# EAGLE design preamp_module_mic_rev2 (EAGLE 9.5.1)
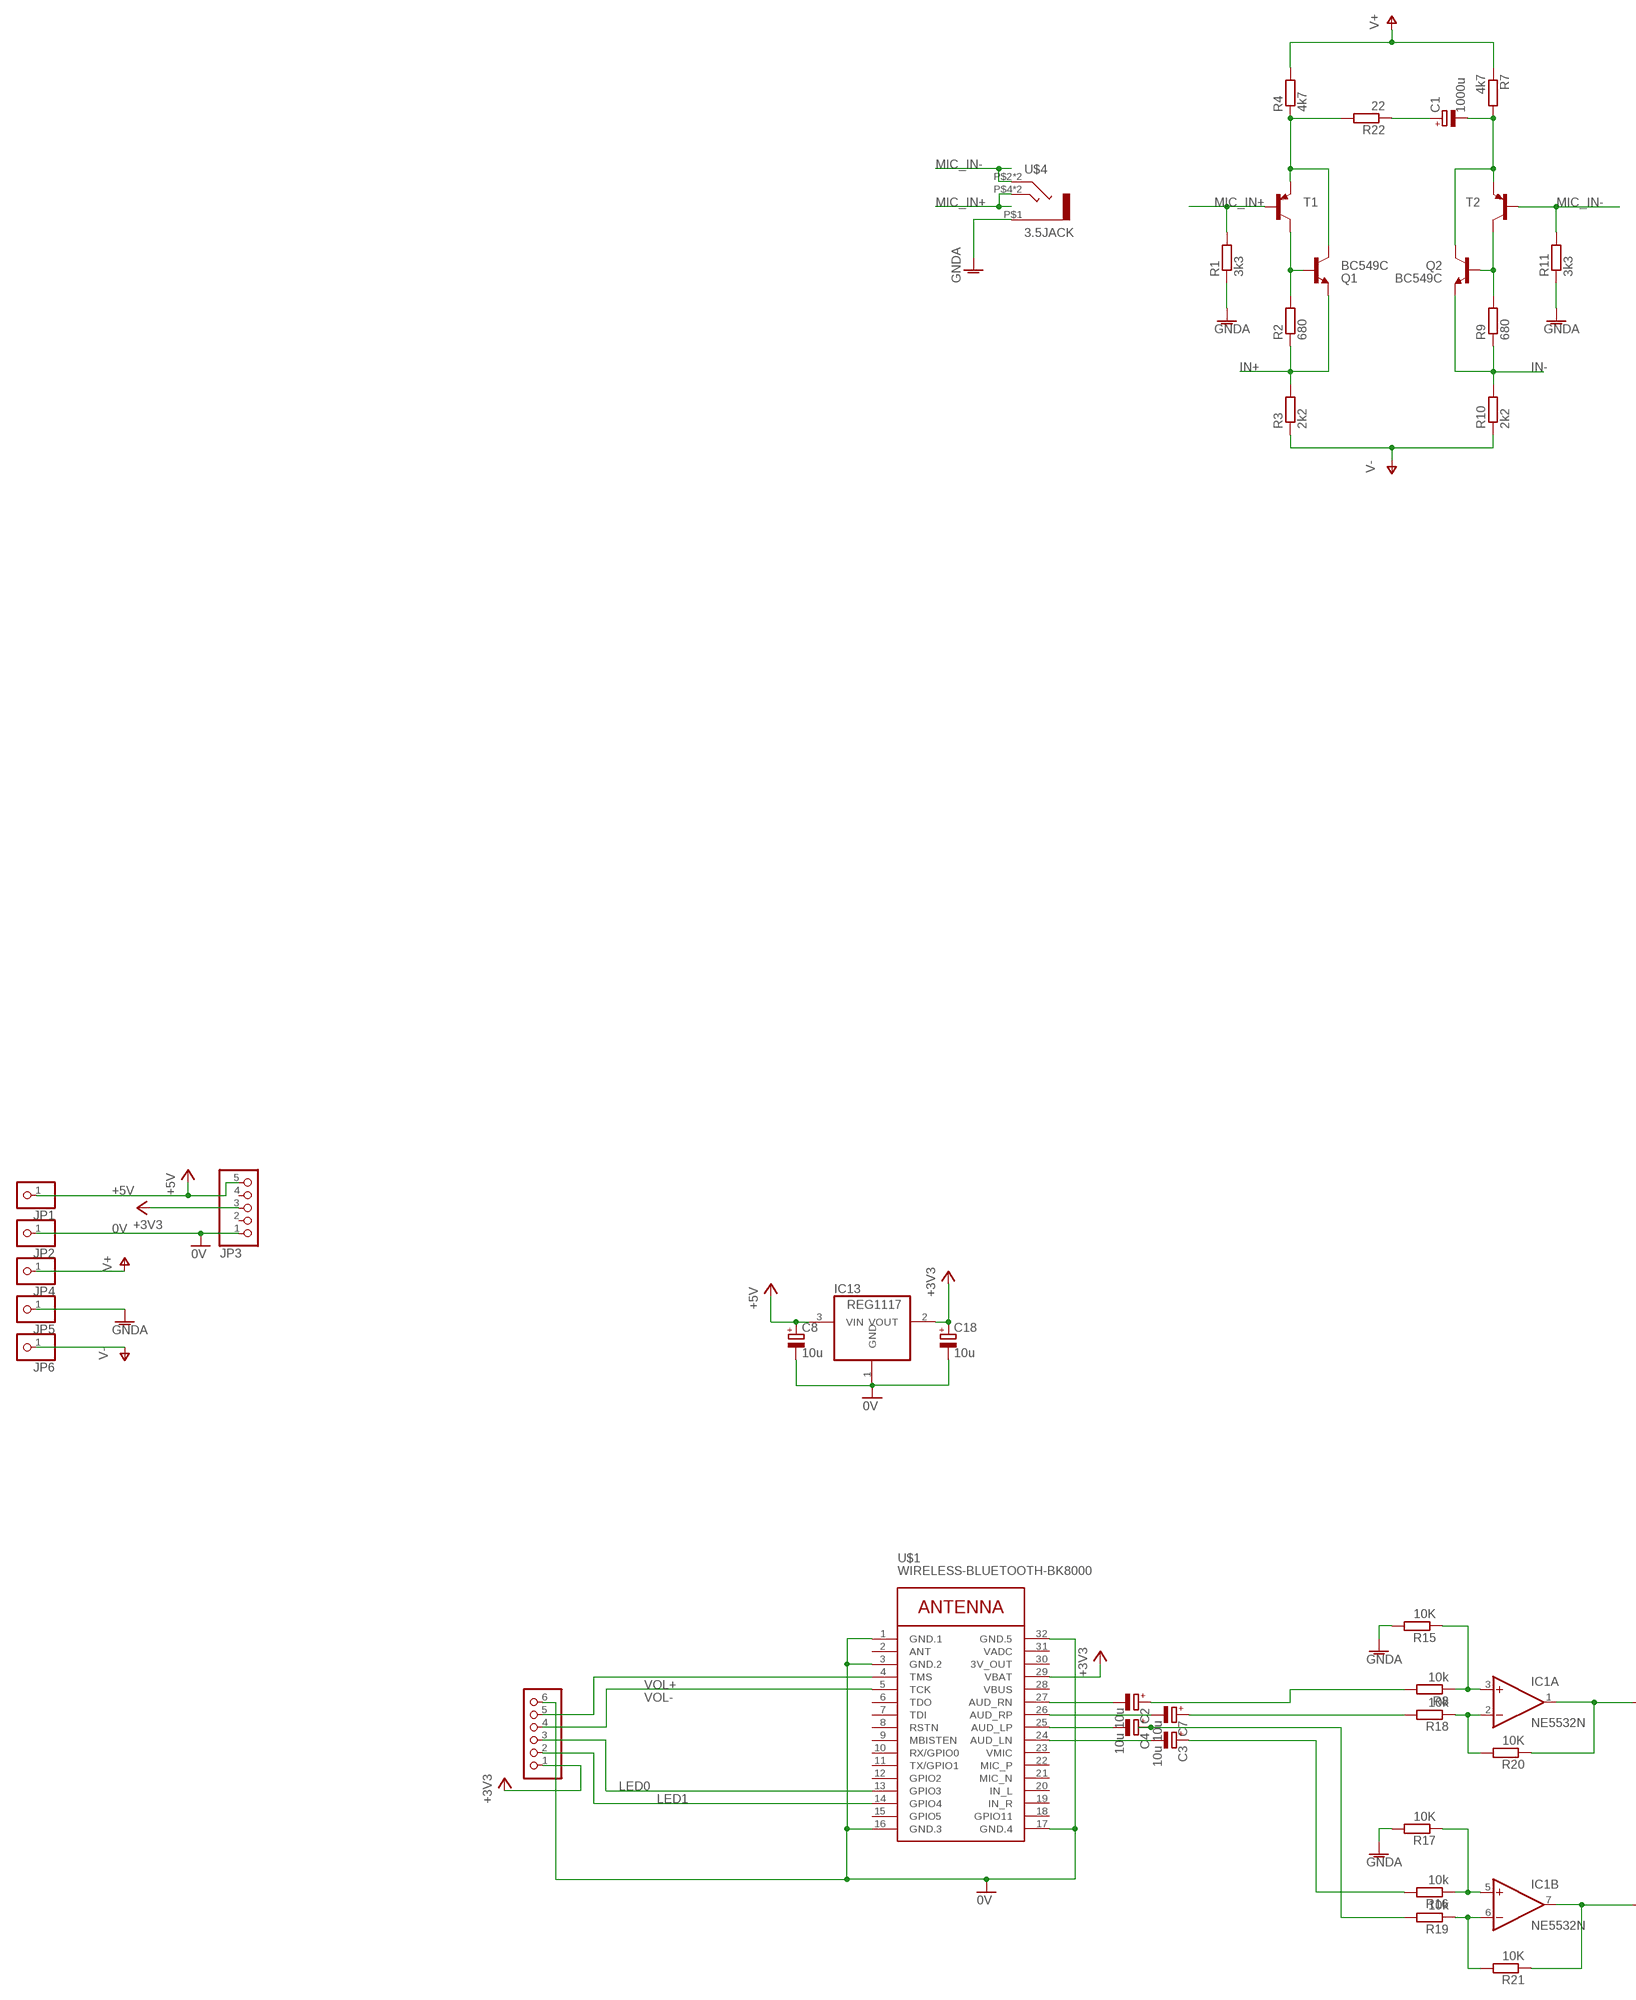
[diagram p0: schematic, sheet 1, part 1 of 2]
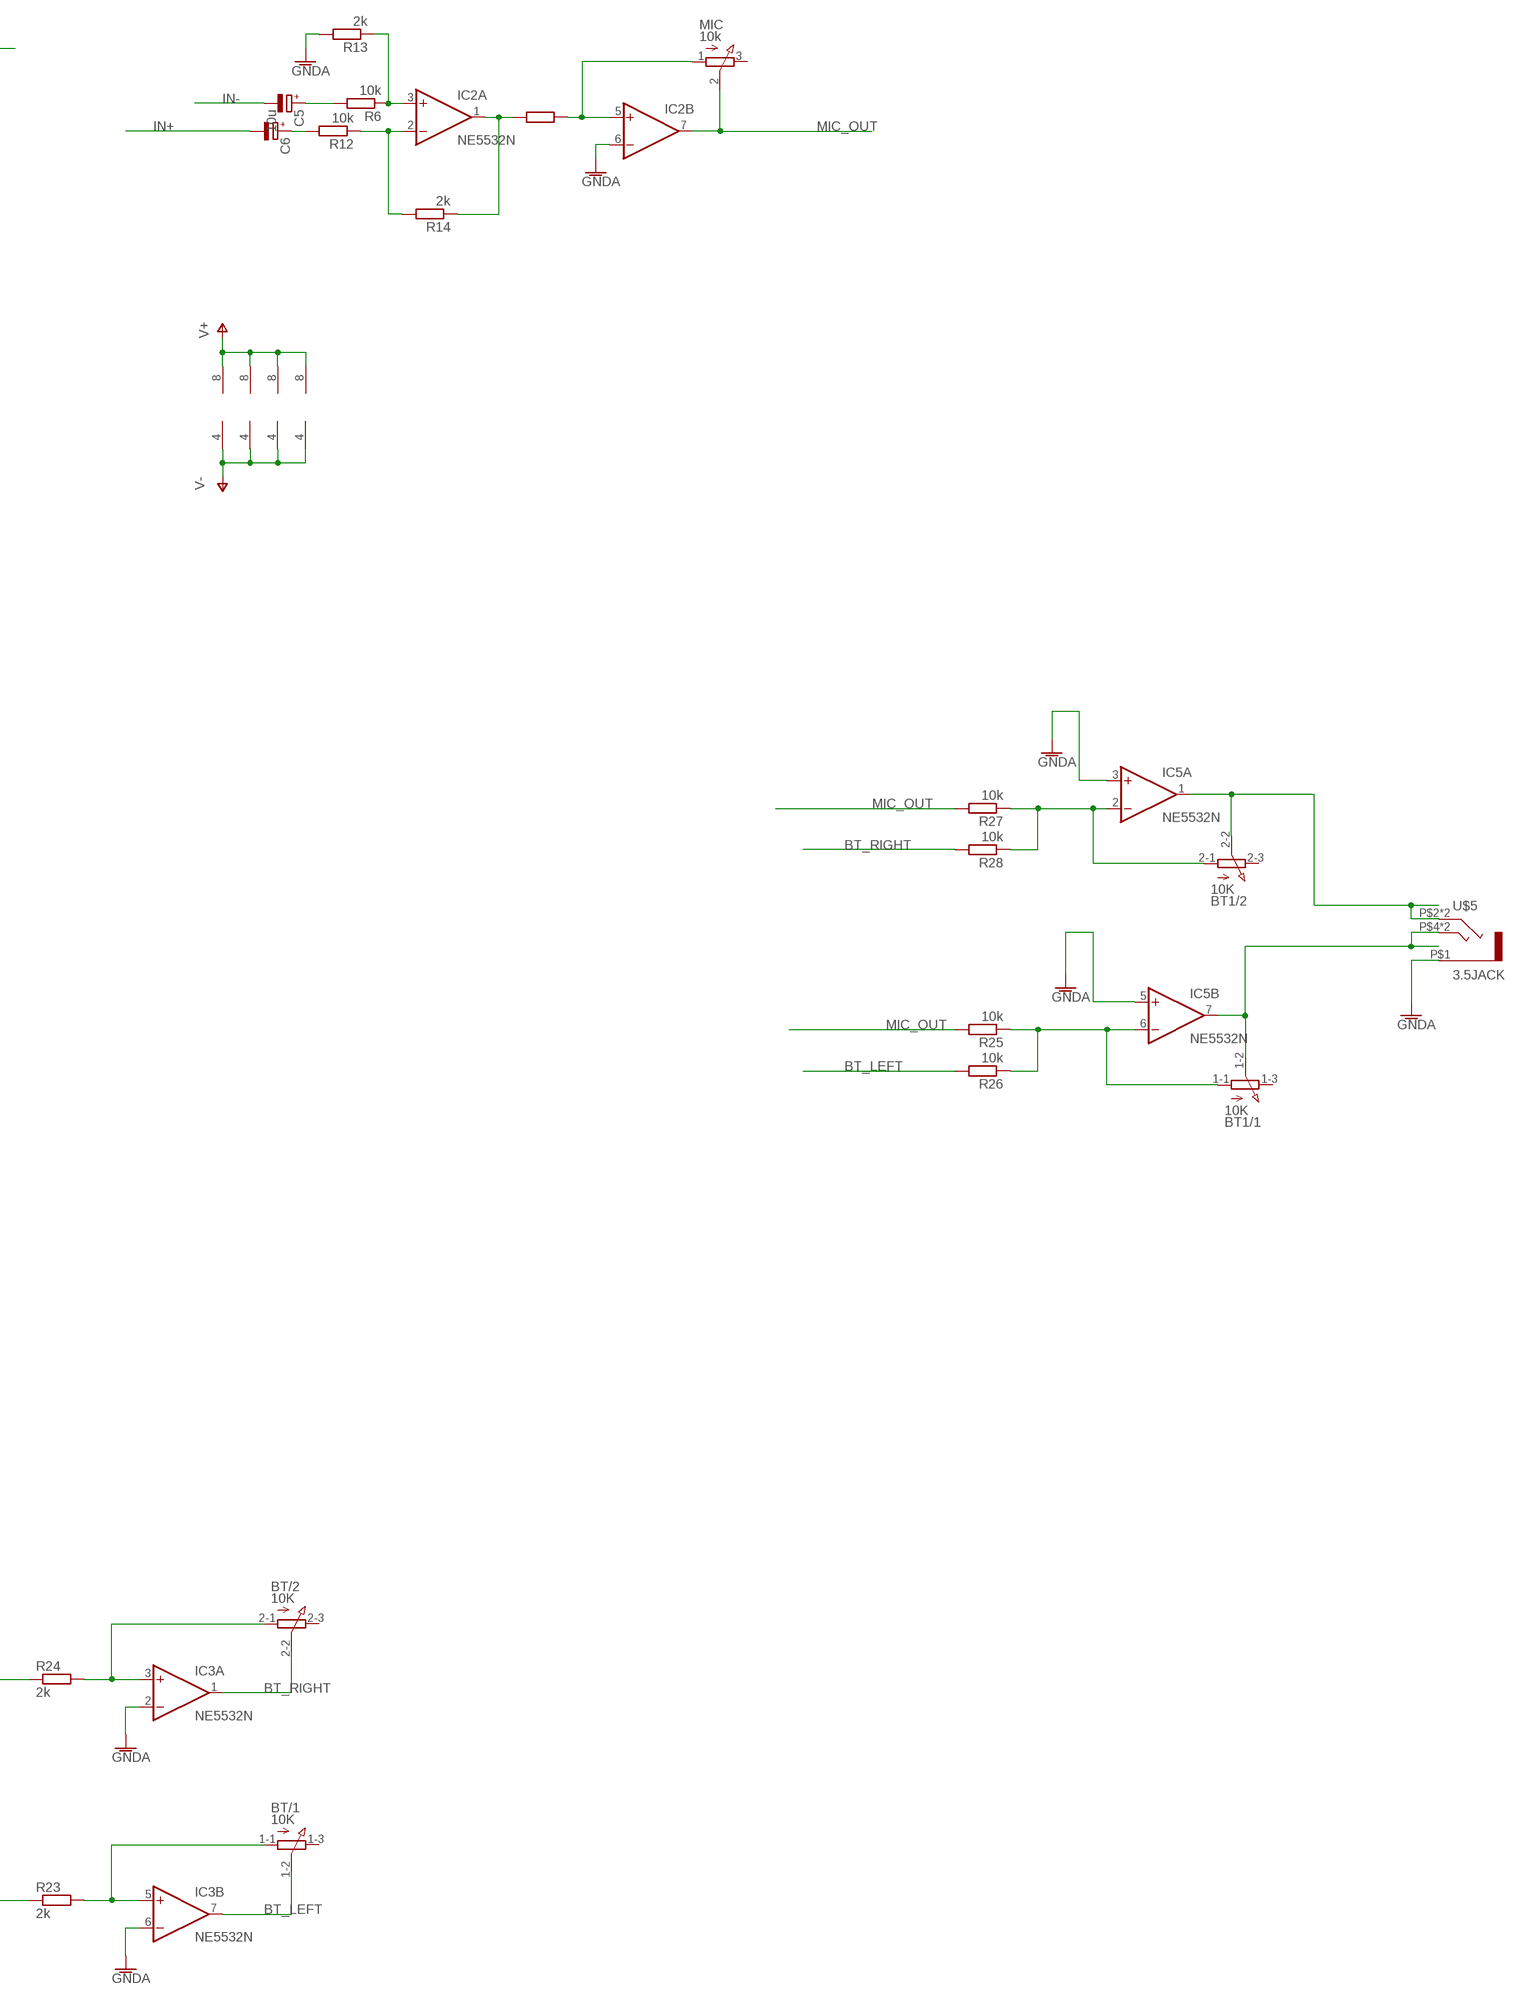
[diagram p1: schematic, sheet 1, part 2 of 2]

## Parts
BT  10K  3RP/1610G  [3RP/1610G]
BT1  10K  3RP/1610G  [3RP/1610G]
C1  1000u  CPOL-EUE5-5  [E5-5]
C2  10u  CPOL-EUE2-5  [E2-5]
C3  10u  CPOL-EUE2-5  [E2-5]
C4  10u  CPOL-EUE2-5  [E2-5]
C5  10u  CPOL-EUE2-5  [E2-5]
C6  10u  CPOL-EUE2-5  [E2-5]
C7  10u  CPOL-EUE2-5  [E2-5]
C8  10u  CPOL-EUE2-5  [E2-5]
C18  10u  CPOL-EUE2-5  [E2-5]
IC1  NE5532N  [DIL08]
IC2  NE5532N  [DIL08]
IC3  NE5532N  [DIL08]
IC5  NE5532N  [DIL08]
IC13  REG1117  [SOT223]
JP1  PINHD-1X1  [1X01]
JP2  PINHD-1X1  [1X01]
JP3  PINHD-1X5  [1X05]
JP4  PINHD-1X1  [1X01]
JP5  PINHD-1X1  [1X01]
JP6  PINHD-1X1  [1X01]
JP7  PINHD-1X6  [1X06]
MIC  10k  3RP/1610N  [3RP/1610N]
Q1  BC549C  [TO92-EBC]
Q2  BC549C  [TO92-EBC]
R1  3k3  R-EU_0207/10  [0207/10]
R2  680  R-EU_0207/10  [0207/10]
R3  2k2  R-EU_0207/10  [0207/10]
R4  4k7  R-EU_0207/10  [0207/10]
R5  2k  R-EU_0207/10  [0207/10]
R6  10k  R-EU_0207/10  [0207/10]
R7  4k7  R-EU_0207/10  [0207/10]
R8  10k  R-EU_0207/10  [0207/10]
R9  680  R-EU_0207/10  [0207/10]
R10  2k2  R-EU_0207/10  [0207/10]
R11  3k3  R-EU_0207/10  [0207/10]
R12  10k  R-EU_0207/10  [0207/10]
R13  2k  R-EU_0207/10  [0207/10]
R14  2k  R-EU_0207/10  [0207/10]
R15  10K  R-EU_0207/10  [0207/10]
R16  10k  R-EU_0207/10  [0207/10]
R17  10K  R-EU_0207/10  [0207/10]
R18  10k  R-EU_0207/10  [0207/10]
R19  10k  R-EU_0207/10  [0207/10]
R20  10K  R-EU_0207/10  [0207/10]
R21  10K  R-EU_0207/10  [0207/10]
R22  22  R-EU_0207/10  [0207/10]
R23  2k  R-EU_0207/10  [0207/10]
R24  2k  R-EU_0207/10  [0207/10]
R25  10k  R-EU_0207/10  [0207/10]
R26  10k  R-EU_0207/10  [0207/10]
R27  10k  R-EU_0207/10  [0207/10]
R28  10k  R-EU_0207/10  [0207/10]
T1  2N4403-PNP-TO92-EBC  [TO92-EBC]
T2  2N4403-PNP-TO92-EBC  [TO92-EBC]
U$1  WIRELESS-BLUETOOTH-BK8000  [WIRELESS-BLUETOOTH-BK8000]
U$4  3.5JACK  [3.5JACK]
U$5  3.5JACK  [3.5JACK]

## Nets
0V: C8.- C18.- IC13.1(GND) JP2.1 JP3.1 JP7.6 U$1.1(GND.1) U$1.3(GND.2) U$1.16(GND.3) U$1.17(GND.4) U$1.32(GND.5)
+3V3: C18.+ IC13.2(VOUT) JP3.3 JP7.1 U$1.29(VBAT)
+5V: C8.+ IC13.3(VIN) JP1.1 JP3.5
BT_LEFT: BT.1-2(/1:S) IC3.7(B:OUT) R26.2
BT_RIGHT: BT.2-2(/2:S) IC3.1(A:OUT) R28.2
GNDA: IC2.6(B:-IN) IC3.2(A:-IN) IC3.6(B:-IN) IC5.3(A:+IN) IC5.5(B:+IN) JP5.1 R1.1 R11.1 R13.2 R15.2 R17.2 U$4.P$1 U$5.P$1
IN+: C6.- Q1.E R2.1 R3.2
IN-: C5.- Q2.E R9.1 R10.2
LED0: JP7.3 U$1.13(GPIO3)
LED1: JP7.2 U$1.14(GPIO4)
MIC_IN+: R1.2 T1.B U$4.P$4 U$4.P$5
MIC_IN-: R11.2 T2.B U$4.P$2 U$4.P$3
MIC_OUT: IC2.7(B:OUT) MIC.2(S) R25.2 R27.2
N$1: Q1.B R2.2 T1.C
N$2: Q2.B R9.2 T2.C
N$3: IC2.5(B:+IN) MIC.1(A) R5.2
N$4: C1.- Q2.C R7.2 T2.E
N$5: C2.- U$1.27(AUD_RN)
N$6: Q1.C R4.1 R22.2 T1.E
N$7: IC1.3(A:+IN) R8.1 R15.1
N$8: IC1.5(B:+IN) R16.1 R17.1
N$9: C2.+ R8.2
N$10: C1.+ R22.1
N$11: C6.+ R12.2
N$12: IC2.2(A:-IN) R12.1 R14.2
N$13: C5.+ R6.2
N$14: IC2.3(A:+IN) R6.1 R13.1
N$15: IC2.1(A:OUT) R5.1 R14.1
N$16: C3.- U$1.24(AUD_LN)
N$17: C3.+ R16.2
N$18: IC1.2(A:-IN) R18.1 R20.2
N$19: IC1.6(B:-IN) R19.1 R21.2
N$20: C7.+ R18.2
N$21: IC1.1(A:OUT) R20.1 R24.1
N$22: IC1.7(B:OUT) R21.1 R23.1
N$23: BT.1-1(/1:A) IC3.5(B:+IN) R23.2
N$24: BT.2-1(/2:A) IC3.3(A:+IN) R24.2
N$25: BT1.2-1(/2:A) IC5.2(A:-IN) R27.1 R28.1
N$26: BT1.1-1(/1:A) IC5.6(B:-IN) R25.1 R26.1
N$27: BT1.2-2(/2:S) IC5.1(A:OUT) U$5.P$2 U$5.P$3
N$28: BT1.1-2(/1:S) IC5.7(B:OUT) U$5.P$4 U$5.P$5
N$73: C4.- U$1.25(AUD_LP)
N$74: C7.- U$1.26(AUD_RP)
N$85: C4.+ R19.2
V+: IC1.8(P:V+) IC2.8(P:V+) IC3.8(P:V+) IC5.8(P:V+) JP4.1 R4.2 R7.1
V-: IC1.4(P:V-) IC2.4(P:V-) IC3.4(P:V-) IC5.4(P:V-) JP6.1 R3.1 R10.1
VOL+: JP7.5 U$1.4(TMS)
VOL-: JP7.4 U$1.5(TCK)
Unconnected: BT1.1-3(/1:E) BT1.2-3(/2:E) BT.1-3(/1:E) BT.2-3(/2:E) JP3.2 JP3.4 MIC.3(E) U$1.2(ANT) U$1.6(TDO) U$1.7(TDI) U$1.8(RSTN) U$1.9(MBISTEN) U$1.10(RX/GPIO0) U$1.11(TX/GPIO1) U$1.12(GPIO2) U$1.15(GPIO5) U$1.18(GPIO11) U$1.19(IN_R) U$1.20(IN_L) U$1.21(MIC_N) U$1.22(MIC_P) U$1.23(VMIC) U$1.28(VBUS)

## Power pins joined to a net without a drawn wire
3V_OUT: U$1.30(3V_OUT)
VADC: U$1.31(VADC)

## Library data of the parts
BT BT1 = pot:3RP/1610G: 16mm Potentiometer two level Source: http://www.alphapotentiometers.net/html/16mm_pot_2.html
C1-C8 C18 = rcl:CPOL-EU: POLARIZED CAPACITOR, European symbol; SPICEPREFIX: C
IC1-IC3 IC5 = linear:NE5532: AUDIO AMPLIFIER
IC13 = burr-brown:REG1117: 800mA and 1A Low Dropout (LDO) Positive Regulator 1.8V, 2.5V, 2.85V, 3.3V, 5V, and Adj; MPN: REG1117; OC_FARNELL: 1097566; OC_NEWARK: 14P6981
JP1 JP2 JP4-JP6 = pinhead:PINHD-1X1: PIN HEADER
JP3 = pinhead:PINHD-1X5: PIN HEADER
JP7 = pinhead:PINHD-1X6: PIN HEADER
MIC = pot:3RP/1610N: 16mm Potentiometer one level Source: http://www.alphapotentiometers.net/html/16mm_pot_2.html
Q1 Q2 = transistor-npn:BC549*: NPN Transistor
R1-R28 = rcl:R-EU_: RESISTOR, European symbol; SPICEPREFIX: R
T1 T2 = transistor-neu-to92:*-PNP-: PNP Transistror
U$1 = diy-modules:WIRELESS-BLUETOOTH-BK8000: Bluetooth Audio Module based on BK8000L chip More details available here: http://www.electrodragon.com/w/BK8000L Click here to find device on ebay.com <http://www.ebay.com/sch/bk8000l+module>
U$4 U$5 = personal:3.5JACK

## Net classes
0 default: width 0.2 mm, drill 0.7 mm, clearance 0.1 mm

## Board
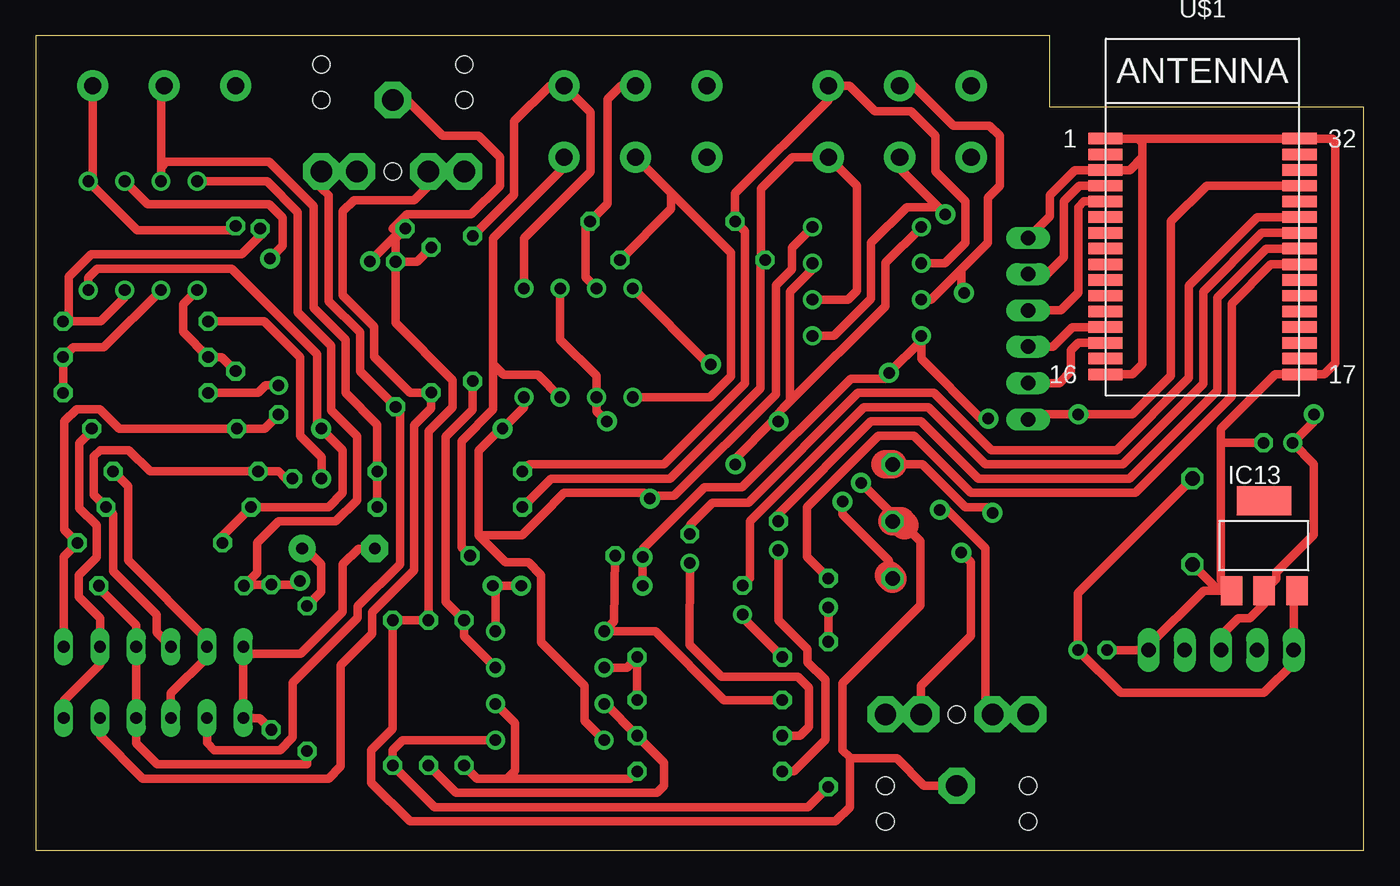
[diagram p2: board, top side]
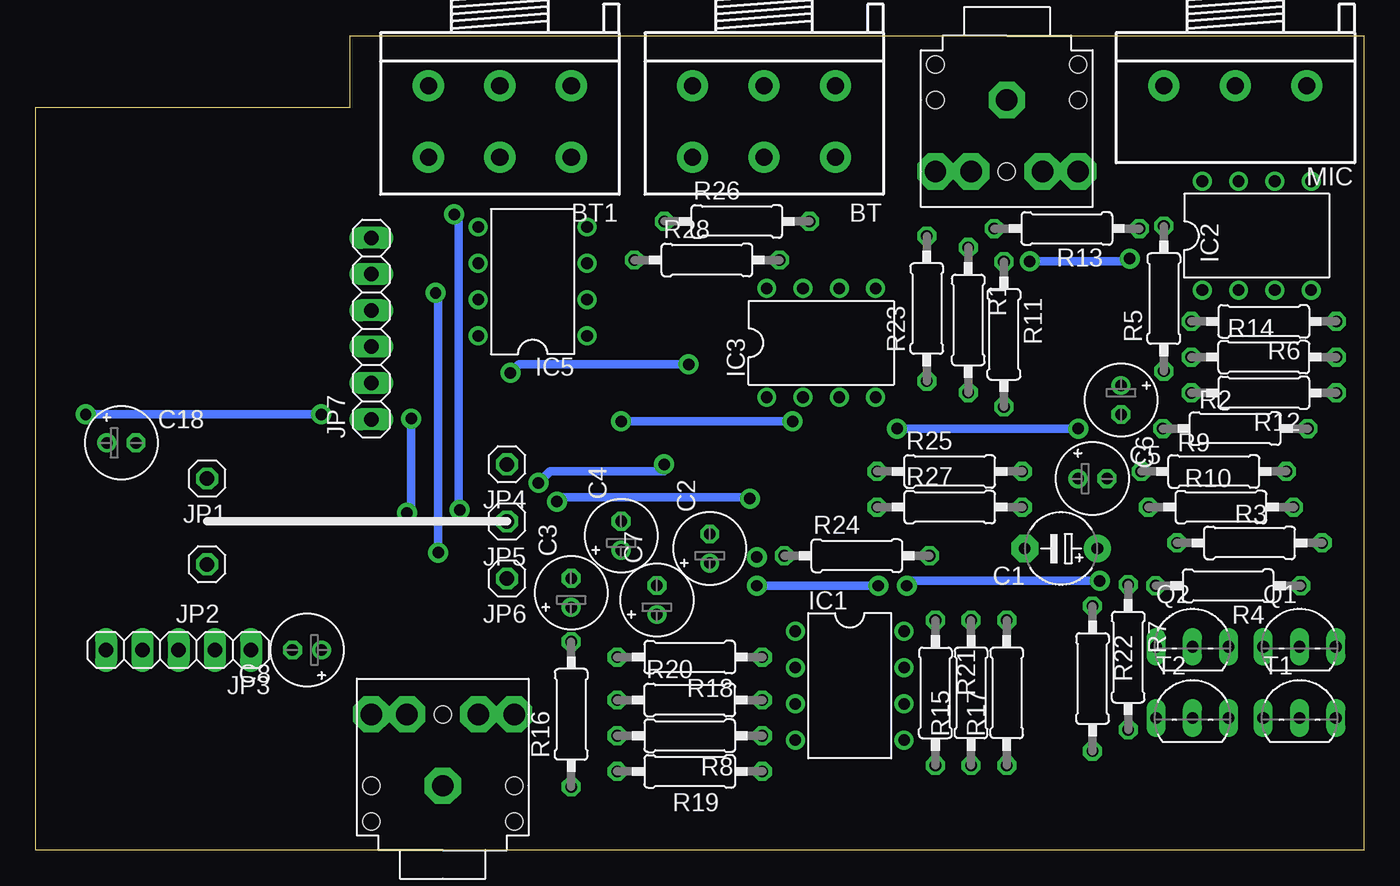
[diagram p3: board, bottom side, seen from below]

Size 93 x 57 mm. Coordinates in mm from the lower left corner, seen from the top.
Outline: 93,0 93,52 71,52 71,57 0,57 0,0 93,0
Copper layers (1*16): Top 0.035mm / dielectric 1.5mm / Bottom 0.035mm
Design rules "default *": minimum track width 0.6mm, minimum drill 0.8mm, track to track 0.4mm, track to pad 0.4mm, pad to pad 0.4mm, via to via 0.4mm, smd to smd 0.4mm, copper to edge 40mil, drill to drill 6mil, minimum pad ring 10mil, minimum via ring 8mil, stop-mask expansion 4mil, vias tented up to drill 0mil, thermal gap 10mil

### Footprints (pad centres in the part's own frame; a part is rotated, then mirrored left to right if it is on the bottom)
3RP/1610G = drill 1.2 pad 2.184: 1-1 -5,0; 1-2 0,0; 1-3 5,0; 2-1 -5,5; 2-2 0,5; 2-3 5,5
E5-5 = drill 0.813 pad 1.905: + -2.54,0 | drill 0.813 pad 1.905 octagon: - 2.54,0
E2-5 = drill 0.813 pad 1.27: + -1.016,0 | drill 0.813 pad 1.27 octagon: - 1.016,0
DIL08 = drill 0.813 pad 1.27: 1 -3.81,-3.81; 2 -1.27,-3.81; 3 1.27,-3.81; 4 3.81,-3.81; 5 3.81,3.81; 6 1.27,3.81; 7 -1.27,3.81; 8 -3.81,3.81
SOT223 = smd 1.499 x 2.007: 1 -2.261,-3.15; 2 0.025,-3.15; 3 2.311,-3.15 | smd 3.81 x 2.007: 4 0,3.15
1X01 = drill 1.016 octagon: 1 0,0
1X05 = drill 1.016 long: 1 -5.08,0; 2 -2.54,0; 3 0,0; 4 2.54,0; 5 5.08,0
1X06 = drill 1.016 long: 1 -6.35,0; 2 -3.81,0; 3 -1.27,0; 4 1.27,0; 5 3.81,0; 6 6.35,0
3RP/1610N = drill 1.2 pad 2.184: 1 -5,0; 2 0,0; 3 5,0
TO92-EBC = drill 0.813 long: B 0,-1.27; C -2.54,-1.27; E 2.54,-1.27
0207/10 = drill 0.813 octagon: 1 -5.08,0; 2 5.08,0
TO92-EBC' = drill 0.813 long: B 0,-1.27; C 2.54,-1.27; E -2.54,-1.27
WIRELESS-BLUETOOTH-BK8000 = smd 2.4 x 0.8: 1 -6.8,5.5; 2 -6.8,4.4; 3 -6.8,3.3; 4 -6.8,2.2; 5 -6.8,1.1; 6 -6.8,0; 7 -6.8,-1.1; 8 -6.8,-2.2; 9 -6.8,-3.3; 10 -6.8,-4.4; 11 -6.8,-5.5; 12 -6.8,-6.6; 13 -6.8,-7.7; 14 -6.8,-8.8; 15 -6.8,-9.9; 16 -6.8,-11; 17 6.8,-11; 18 6.8,-9.9; 19 6.8,-8.8; 20 6.8,-7.7; 21 6.8,-6.6; 22 6.8,-5.5; 23 6.8,-4.4; 24 6.8,-3.3; 25 6.8,-2.2; 26 6.8,-1.1; 27 6.8,0; 28 6.8,1.1; 29 6.8,2.2; 30 6.8,3.3; 31 6.8,4.4; 32 6.8,5.5
3.5JACK = drill 1.5 pad 2.54 octagon: P$1 0,0; P$2 5,5; P$3 5,2.5; P$4 5,-2.5; P$5 5,-5 | hole 1.2: 5,0; 0,-5; -2.5,-5; 0,5; -2.5,5

### Placement (x,y rotation side)
BT  42,53.5 180 bottom
BT1  60.5,53.5 180 bottom
C1  21.2,21.1 180 bottom
C2  45.8,21.1 90 bottom
C3  55.5,18 90 bottom
C4  52,22 90 bottom
C5  19,26 0 bottom
C6  17,31.5 270 bottom
C7  49.5,17.5 90 bottom
C8  74,14 180 bottom
C18  87,28.5 0 bottom
IC1  36,11.5 270 bottom
IC2  7.5,43 0 bottom
IC3  38,35.5 0 bottom
IC5  58.2,39.8 90 bottom
IC13  86,21.3 0 top
JP1  81,26 180 bottom
JP2  81,20 180 bottom
JP3  83,14 180 bottom
JP4  60,27 180 bottom
JP5  60,23 180 bottom
JP6  60,19 180 bottom
JP7  69.5,36.5 90 bottom
MIC  9,53.5 180 bottom
Q1  4.5,15.5 0 bottom
Q2  12,15.5 0 bottom
R1  27.7,37.1 270 bottom
R2  9,29.5 0 bottom
R3  8,21.5 0 bottom
R4  9.5,18.5 180 bottom
R5  14,38.6 90 bottom
R6  7,37 180 bottom
R7  16.5,13.5 270 bottom
R8  47.2,8 180 bottom
R9  10.5,26.5 0 bottom
R10  10,24 0 bottom
R11  25.2,36.1 270 bottom
R12  7,32 180 bottom
R13  20.8,43.5 180 bottom
R14  7,34.5 0 bottom
R15  27.5,11 90 bottom
R16  55.5,9.5 90 bottom
R17  25,11 90 bottom
R18  47.2,13.5 180 bottom
R19  47.2,5.5 180 bottom
R20  47.2,10.5 0 bottom
R21  30,11 270 bottom
R22  19,12 270 bottom
R23  30.6,37.9 90 bottom
R24  35.5,20.6 0 bottom
R25  29,26.5 0 bottom
R26  43.9,44 0 bottom
R27  29,24 0 bottom
R28  46,41.3 0 bottom
T1  [TO92-EBC']  4.5,10.5 0 bottom
T2  [TO92-EBC']  12,10.5 0 bottom
U$1  81.7,44.3 0 top
U$4  25,52.5 270 bottom
U$5  64.5,4.5 90 bottom

### Tracks (layer width: path | path; a pad name or v marks a point on that pad's centre or on a via)
0V
  Top 0.6: IC13.1 82.85,18.15 JP2.1 | IC13.1 81.78,18.15 77.92,14.29 JP3.1 C8.- | IC13.1 83,18.89 83,28.5 | 83,28.5 83,29.5 86.8,33.3 U$1.17 90.24,33.3 91,34.06 91,49.64 90.84,49.8 U$1.32 77.2,49.8 | C18.- 83,28.5 | U$1.1 77.2,49.8 | 77.2,49.8 77.5,49.5 77.5,48.5 | 77.5,48.5 76.6,47.6 U$1.3 72.77,47.6 71,45.83 71,44.35 JP7.6 | 77.5,48.5 77.5,34 76.8,33.3 U$1.16
+3V3  (via drill 0.8 pad 1.4)
  Top 0.6: v89.5,30.5 89.5,29.98 C18.+ 89.5,27.02 89.5,22.08 86.86,19.44 86.86,18.99 IC13.2 86.03,17.25 85,16.22 84.22,16.22 83,15 JP3.3 | U$1.29 82,46.5 79.5,44 79.5,33.21 76.79,30.5 v73,30.5 69.85,30.5 JP7.1
  Bottom 0.6: v89.5,30.5 v73,30.5
+5V
  Top 0.6: JP1.1 72.98,17.98 C8.+ 75.98,11 86,11 88.08,13.08 JP3.5 88.08,17.92 IC13.3
BT_LEFT
  Top 0.6: IC3.7 38.5,40.08 38.5,43.68 R26.2 40.05,45.23 40.05,52.55 41,53.5 BT.1-2
BT_RIGHT
  Top 0.6: IC3.1 47.2,31.69 48.68,33.17 48.68,41.82 44.5,46 | 44.5,46 BT.2-2 | R28.2 44.5,44.88 44.5,46
GNDA  (via drill 0.8 pad 1.4)
  Top 0.6: IC2.6 7.84,45.2 16.34,45.2 17.3,44.24 17.3,42.3 v16.4,41.4 | U$4.P$1 26,52.5 28.5,50 31,50 32.5,48.5 32.5,46.5 30.5,44.5 26,44.5 25,43.5 R13.2 | R13.2 25.2,42.82 R11.1 | R1.1 26.7,41.18 R11.1 | R11.1 25.2,36.9 29.2,32.9 29.2,31 27.5,29.3 R15.2 R17.2 25,8.5 23.5,7 23.5,4.7 26.2,2 56,2 57,3 57,6.5 | v40,30 39.27,30.73 IC3.2 39.27,33.19 36.73,35.73 IC3.6 | IC5.5 59.5,41.1 59.5,38.08 52.83,31.41 | 57,6.5 56.5,7 56.5,11.67 61.96,17.13 61.96,21.61 60.85,22.73 | 57,6.5 57.08,6.42 60.29,6.42 62.21,4.5 U$5.P$1 | IC5.3 54.39,40.65 52.83,39.09 52.83,31.41 | 52.83,31.41 52.33,30.91 51.9,30.48 51.9,30.1 v52,30 51.59,30 48.98,27.39 v48.98,26.99 | JP5.1 60,23.5 v57.8,25.7 | R13.2 25.7,43.5 v23.4,41.2
  Top 2: 60.85,22.73 60.58,23 JP5.1
  Bottom 0.6: v52,30 v40,30 | v57.8,25.7 57,26.5 48.98,26.5 v48.98,26.99 | v23.4,41.2 16.6,41.2 v16.4,41.4
IN+
  Top 0.6: Q1.E 1.96,20.54 R3.2 2,22.42 2,30 2.86,30.86 4.48,30.86 5.84,29.5 R2.1 16.02,29.5 C6.-
IN-
  Top 0.6: Q2.E 8.46,15.23 8.46,16.46 5.42,19.5 5.42,23.5 R10.2 4.06,24.86 4.06,27.56 4.5,28 6.5,28 8,26.5 R9.1 17,26.5 17.5,26 C5.-
LED0
  Top 0.6: U$1.13 72.6,36.6 71.23,35.23 JP7.3
LED1
  Top 0.6: JP7.2 71.69,32.69 72.5,33.5 72.5,35 73,35.5 U$1.14
MIC_IN+
  Top 0.6: T1.B 4.5,8 7.5,5 20.5,5 21.36,5.86 21.36,12.95 23.55,15.14 23.55,16.64 26.5,19.59 26.5,29.72 27.7,30.92 R1.2 26.2,32.02 23.7,34.52 23.7,36.64 21.51,38.84 21.51,44.71 22.3,45.5 26.5,45.5 27.5,46.5 U$4.P$4 U$4.P$5
MIC_IN-
  Top 0.6: T2.B 12,7.5 12.5,7 17.1,7 18,7.9 18,11.7 22.55,16.25 22.55,17.05 25.5,20 25.5,30.72 R11.2 22.7,33.52 22.7,36.23 20.51,38.42 20.51,45.82 20,46.33 U$4.P$2 U$4.P$3
MIC_OUT
  Top 0.6: R27.2 R25.2 23.92,29.78 21.7,32 21.7,35.71 19.45,37.96 19.45,45.06 16.34,48.17 9.17,48.17 8.77,47.77 IC2.7 8.77,53.27 MIC.2
N$1
  Top 0.6: T1.C 1.96,10.46 4.5,13 Q1.B 4.5,16.23 3,17.73 3,19.22 4.28,20.5 4.28,22.72 3.06,23.94 3.06,28.47 3.92,29.33 R2.2
N$2
  Top 0.6: T2.C 9.46,10.96 12,13.5 Q2.B 12,14.73 6.46,20.27 6.46,25.46 R9.2
N$3
  Top 0.6: R5.2 13.7,43.38 7.12,43.38 IC2.5 4,47.12 MIC.1
N$4
  Top 0.6: R7.2 15.69,9.23 T2.E Q2.C 15.04,13.73 18.54,13.73 21.5,16.69 21.5,20 22.6,21.1 C1.-
N$5
  Top 0.6: U$1.27 85.56,44.3 80.75,39.49 80.75,33.04 75.71,28 66.91,28 62.91,32 57.59,32 49.9,24.32 47.4,24.32 45.8,22.72 C2.-
N$6
  Top 0.6: R4.1 4.42,18.35 7.04,15.73 Q1.C T1.E 7.04,7.46 8.5,6 19,6 R22.2
N$7
  Top 0.6: R15.1 29.42,4 43.5,4 44,4.5 44,6.12 R8.1 39.89,10.23 IC1.3
N$8
  Top 0.6: R16.1 54.08,3 27.92,3 R17.1 25,7 25.69,7.69 IC1.5
N$9
  Top 0.6: R8.2 53.5,8 54.14,8.64 54.14,11.36 53.36,12.14 48.02,12.14 45.8,14.36 C2.+
N$10
  Top 0.6: C1.+ 18.9,21.1 20,20 20,18.08 R22.1
N$11
  Top 0.6: R12.2 15.58,32 16.1,32.52 C6.+
N$12
  Top 0.6: IC2.2 4.77,35.19 2.61,35.19 R14.2 R12.1
N$13
  Top 0.6: C5.+ 20.02,27.5 18.52,29 18.52,34.48 16,37 R6.2
N$14
  Top 0.6: IC2.3 6.23,38.69 4.54,37 R6.1 2.33,37.41 2.33,40.13 3.89,41.69 14.41,41.69 15.72,43 R13.1
N$15
  Top 0.6: IC2.1 10.31,38.19 10.31,36.27 R14.1 13.02,34.5 R5.1
N$16
  Top 0.6: C3.- 54,20.52 54,24 59,29 61.5,29 65.5,25 77,25 83.75,31.75 83.75,38.25 86.5,41 U$1.24
N$17
  Top 0.6: R16.2 C3.+
N$18
  Top 0.6: R20.2 R18.1 41.39,12.77 IC1.2
N$19
  Top 0.6: R19.1 41.62,5 33,5 | 33,5 30.92,5 R21.2 | 33,5 33.55,5.55 33.55,8.87 IC1.6
N$20
  Top 0.6: R18.2 49.5,16.28 C7.+
N$21
  Top 0.6: R20.1 48.2,10.5 43.39,15.31 IC1.1 40.51,16.01 R24.1
N$22
  Top 0.6: R23.1 30.6,30.82 28.7,28.92 28.7,17.38 R21.1 30,14.96 IC1.7
N$23
  Top 0.6: R23.2 33.5,45.88 33.5,51 36,53.5 BT.1-1 38.86,51.64 38.86,47.48 34.19,42.81 IC3.5
N$24
  Top 0.6: IC3.3 35.16,33.26 32.77,33.26 32.03,34 | BT.2-1 37,47.8 32.03,42.83 32.03,34 | R24.2 29.82,21.2 29.82,28.63 32.03,30.84 32.03,34
N$25
  Top 0.6: R27.1 36.08,26 44.41,26 50.75,32.34 50.75,40.97 R28.1 50.78,41.6 50.78,46.28 53,48.5 BT1.2-1 57.5,46.5 57.5,39.14 56.89,38.53 IC5.2
N$26
  Top 0.6: R25.1 34.58,27 44,27 49.68,32.68 49.68,43.3 R26.1 48.98,45.98 55.5,52.5 BT1.1-1 56.97,53.5 58.76,51.71 61.29,51.71 63,50 63,47.5 65.09,45.41 65.09,42.5 63.66,41.07 IC5.6
N$27  (via drill 0.8 pad 1.4)
  Top 0.6: U$5.P$2 U$5.P$3 66.5,10 66.5,21.11 63.8,23.8 v63.3,23.8 | BT1.2-2 60.5,47.69 v63.69,44.5 63.19,45 61,45 58.5,42.5 58.5,38.6 55.89,35.99 IC5.1
  Bottom 0.6: v63.3,23.8 63.4,23.9 63.4,44.21 v63.69,44.5
N$28  (via drill 0.8 pad 1.4)
  Top 0.6: BT1.1-2 61.46,53.51 64.26,50.71 66.79,50.71 67.5,50 67.5,46.5 66.67,45.67 66.67,42.5 64.83,40.66 | U$5.P$5 U$5.P$4 62,11.5 65.5,15 65.5,20.13 v64.81,20.81 | IC5.7 62.7,38.53 64.83,40.66 | 64.83,40.66 64.83,39.16 v65,39
  Bottom 0.6: v64.81,20.81 64.81,39 v65,39
N$73
  Top 0.6: U$1.25 86.19,42.1 82.75,38.66 82.75,32.16 76.59,26 66,26 62,30 58.48,30 52,23.52 C4.-
N$74
  Top 0.6: U$1.26 85.87,43.2 81.75,39.08 81.75,32.63 76.12,27 66.5,27 62.5,31 58,31 50,23 50,19.02 C7.-
N$85
  Top 0.6: R19.2 53.08,5.5 55.3,7.72 55.3,11.9 54.05,13.15 54.05,14.05 52,16.1 C4.+
V+  (via drill 0.8 pad 1.4)
  Top 0.6: IC2.8 16.19,46.81 18.35,44.65 18.35,37.65 20.7,35.3 20.7,30.78 22.5,28.98 22.5,24.49 21.01,23 17,23 15.5,21.5 15.5,19.42 R4.2 14.66,18.58 R7.1 18.24,18.58 v18.5,18.84 | v66.7,30.2 66.2,30.2 62.01,34.39 IC5.8 62.01,35.65 v59.76,33.4 59.85,33.49 60.01,33.49 59.52,33 57.07,33 49.45,25.38 46.82,25.38 42.5,21.06 v42.5,20.5 v42.5,18.5 | v67,23.6 66.6,24 65.09,24 62.09,27 JP4.1 | IC1.8 32.19,18.31 v32,18.5 v34,18.5 | v47.28,34 47.12,34 IC3.8
  Top 2: JP4.1 59.5,27
  Bottom 0.6: v66.7,30.2 66.7,23.9 v67,23.6 | v18.5,18.84 31.66,18.84 v32,18.5 | v42.5,18.5 v34,18.5 | v47.28,34 59.16,34 v59.76,33.4
V-  (via drill 0.8 pad 1.4)
  Top 0.6: R3.1 13.08,22 R10.1 20.5,24 21.5,25 21.5,28 v20,29.5 19.7,29.8 19.7,34.71 13.72,40.69 4.31,40.69 3.69,40.07 IC2.4 | 59.75,19.25 59.75,20.25 56.5,23.5 v56.5,24.39 | IC1.4 38.45,9.05 38.45,11.5 35.4,14.55 35.4,19.24 34.5,20.14 32.92,20.14 31.02,22.04 | IC5.4 52.94,42.16 52.94,40.66 51.83,39.55 51.83,31.9 44.71,24.79 42.81,24.79 42.8,24.8 | IC3.4 34.19,31 v32.69,29.5 32.56,29.5 31.02,27.96 31.02,22.04 | 31.02,22.04 34.04,22.04 35.44,23.44 37,25 42.6,25 42.8,24.8 | 42.8,24.8 v43,24.6
  Top 2: JP6.1 59.75,19.25
  Bottom 0.6: v20,29.5 v32.69,29.5 | v56.5,24.39 56.2,24.69 43.09,24.69 v43,24.6
VOL+
  Top 0.6: U$1.4 73.09,46.5 72,45.41 72,41.5 70.81,40.31 JP7.5
VOL-
  Top 0.6: JP7.4 71.77,37.77 73,39 73,45 73.4,45.4 U$1.5

### Text on the board
tPlace: //TODO 4 chargere de 5 volti legate in paralel / //celulele legate in serie sa faca 20V si cu gnd virtual la 10V